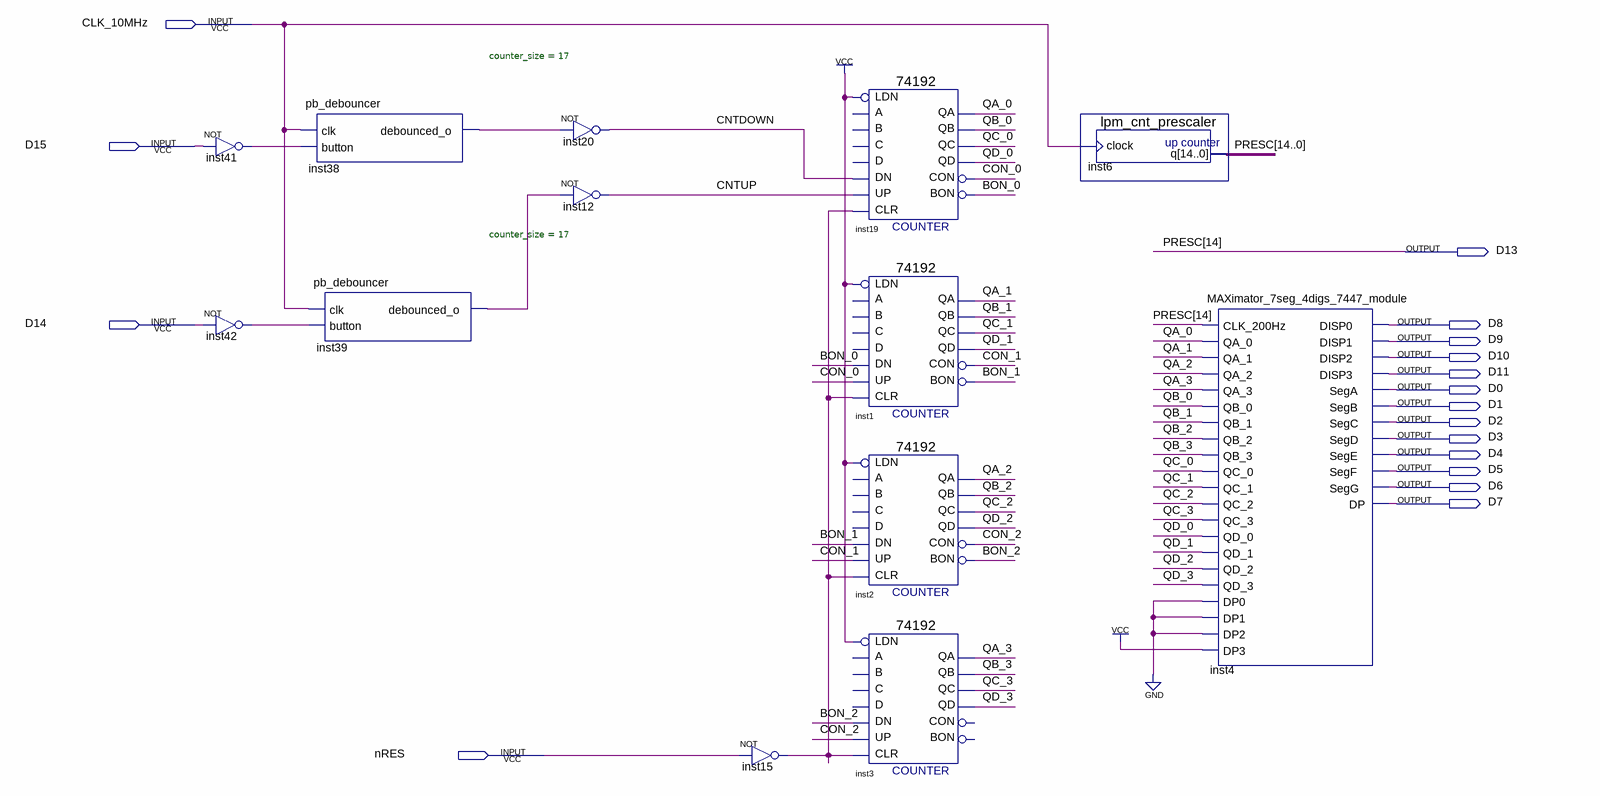
[diagram p0: schematic sheet]
// Quartus schematic MAXimator_7447_main.bdf as structural Verilog: 13 symbols, 17 pins
module MAXimator_7447_main (
  input  CLK_10MHz,
  input  D15,
  input  D14,
  input  nRES,
  output D13,
  output D8,
  output D9,
  output D10,
  output D11,
  output D0,
  output D1,
  output D2,
  output D3,
  output D4,
  output D5,
  output D6,
  output D7
);

  wire BON_0, BON_1, BON_2, CNTDOWN, CNTUP, CON_0, CON_1, CON_2, inst15_out, inst38_debounced_o,
       inst39_debounced_o, inst41_out, inst42_out, QA_0, QA_1, QA_2, QA_3, QB_0, QB_1, QB_2, QB_3, QC_0,
       QC_1, QC_2, QC_3, QD_0, QD_1, QD_2, QD_3;
  wire [13:0] PRESC;

  not inst41 (inst41_out, D15);
  not inst42 (inst42_out, D14);
  pb_debouncer #(.counter_size(17)) inst38 (.clk(CLK_10MHz), .button(inst41_out), .debounced_o(inst38_debounced_o));
  pb_debouncer #(.counter_size(17)) inst39 (.clk(CLK_10MHz), .button(inst42_out), .debounced_o(inst39_debounced_o));
  not inst20 (CNTDOWN, inst38_debounced_o);
  not inst12 (CNTUP, inst39_debounced_o);
  not inst15 (inst15_out, nRES);
  \74192  inst19 (
    .CLR(inst15_out), .UP(CNTUP), .DN(CNTDOWN), .LDN(1'b1), .QB(QB_0), .BON(BON_0), .CON(CON_0), .QA(QA_0),
    .QC(QC_0), .QD(QD_0));  // open: D, C, A, B
  \74192  inst1 (
    .CLR(inst15_out), .UP(CON_0), .DN(BON_0), .LDN(1'b1), .QB(QB_1), .BON(BON_1), .CON(CON_1), .QA(QA_1),
    .QC(QC_1), .QD(QD_1));  // open: D, C, A, B
  \74192  inst2 (
    .CLR(inst15_out), .UP(CON_1), .DN(BON_1), .LDN(1'b1), .QB(QB_2), .BON(BON_2), .CON(CON_2), .QA(QA_2),
    .QC(QC_2), .QD(QD_2));  // open: D, C, A, B
  \74192  inst3 (
    .CLR(inst15_out), .UP(CON_2), .DN(BON_2), .LDN(1'b1), .QB(QB_3), .QA(QA_3), .QC(QC_3), .QD(QD_3));  // open: D, C, A, B, BON, CON
  lpm_cnt_prescaler inst6 (.clock(CLK_10MHz), .q({D13, PRESC}));
  MAXimator_7seg_4digs_7447_module inst4 (
    .CLK_200Hz(D13), .QA_0(QA_0), .QA_1(QA_1), .QA_2(QA_2), .QA_3(QA_3), .QB_0(QB_0), .QB_1(QB_1),
    .QB_2(QB_2), .QB_3(QB_3), .QC_0(QC_0), .QC_1(QC_1), .QC_2(QC_2), .QC_3(QC_3), .QD_0(QD_0), .QD_1(QD_1),
    .QD_2(QD_2), .QD_3(QD_3), .DP0(1'b0), .DP1(1'b0), .DP2(1'b0), .DP3(1'b1), .DISP0(D8), .DISP1(D9),
    .DISP2(D10), .DISP3(D11), .SegA(D0), .SegB(D1), .SegC(D2), .SegD(D3), .SegE(D4), .SegF(D5), .SegG(D6),
    .DP(D7));

  // Other names for the same wires on the sheet: PRESC[14] = D13
endmodule
